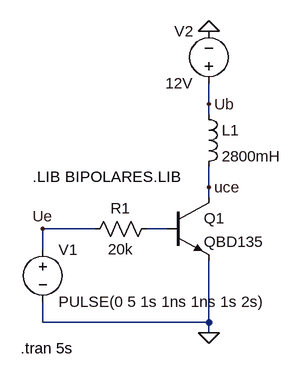
[diagram p0: schematic Draft1.asc]
Draft1.asc, the LTspice schematic file:
Version 4
SHEET 1 880 680
WIRE 208 -64 208 -96
WIRE 208 -48 208 -64
WIRE 208 64 208 32
WIRE 208 80 208 64
WIRE 32 128 -48 128
WIRE 144 128 112 128
WIRE -48 160 -48 128
WIRE -48 272 -48 240
WIRE 208 272 208 176
WIRE 208 272 -48 272
WIRE 208 288 208 272
FLAG 208 288 0
FLAG -48 128 Ue
FLAG 208 64 uce
FLAG 208 -176 0
FLAG 208 -64 Ub
SYMBOL voltage -48 144 R0
WINDOW 123 0 0 Left 0
WINDOW 39 0 0 Left 0
SYMATTR InstName V1
SYMATTR Value PULSE(0 5 1s 1ns 1ns 1s 2s)
SYMBOL res 128 112 R90
WINDOW 0 0 56 VBottom 2
WINDOW 3 32 56 VTop 2
SYMATTR InstName R1
SYMATTR Value 20k
SYMBOL npn 144 80 R0
SYMATTR InstName Q1
SYMATTR Value QBD135
SYMBOL ind 192 -64 R0
SYMATTR InstName L1
SYMATTR Value 2800mH
SYMATTR SpiceLine Rser=400
SYMBOL voltage 208 -80 R180
WINDOW 0 24 96 Left 2
WINDOW 3 24 16 Left 2
WINDOW 123 0 0 Left 0
WINDOW 39 0 0 Left 0
SYMATTR InstName V2
SYMATTR Value 12V
TEXT -82 312 Left 2 !.tran 5s
TEXT -64 48 Left 2 !.LIB BIPOLARES.LIB

The netlist it stands for:
* Draft1.asc
V1 Ue 0 PULSE(0 5 1s 1ns 1ns 1s 2s)
R1 N001 Ue 20k
Q1 uce N001 0 0 QBD135
L1 Ub uce 2800mH Rser=400
V2 Ub 0 12V
.model NPN NPN
.model PNP PNP
.lib standard.bjt
.tran 5s
.LIB BIPOLARES.LIB
.backanno
.end